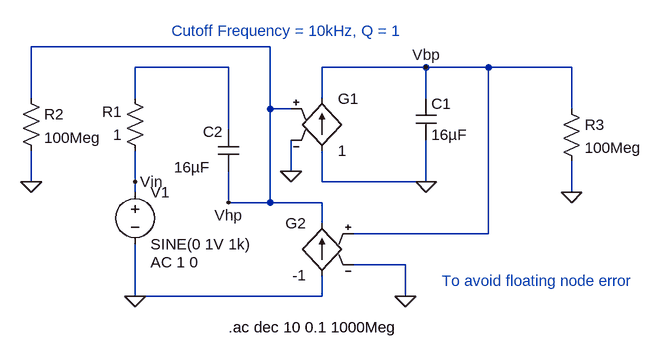
[diagram p0: schematic GmCInductor.asc]
GmCInductor.asc, the LTspice schematic file:
Version 4
SHEET 1 880 680
WIRE 288 -16 -80 -16
WIRE 224 16 80 16
WIRE 528 16 368 16
WIRE 624 16 528 16
WIRE 752 16 624 16
WIRE -80 64 -80 -16
WIRE 80 64 80 16
WIRE 368 64 368 16
WIRE 528 64 528 16
WIRE 288 80 288 -16
WIRE 320 80 288 80
WIRE 752 80 752 16
WIRE 224 112 224 16
WIRE 320 176 320 128
WIRE -80 192 -80 144
WIRE 80 192 80 144
WIRE 368 192 368 144
WIRE 528 192 528 128
WIRE 528 192 368 192
WIRE 80 208 80 192
WIRE 752 208 752 160
WIRE 224 224 224 176
WIRE 288 224 288 80
WIRE 288 224 224 224
WIRE 368 224 288 224
WIRE 368 256 368 224
WIRE 624 272 624 16
WIRE 624 272 416 272
WIRE 496 320 416 320
WIRE 80 368 80 288
WIRE 368 368 368 336
WIRE 368 368 80 368
WIRE 496 368 496 320
FLAG 496 368 0
FLAG 320 176 0
FLAG 80 368 0
FLAG 528 192 0
FLAG 80 192 Vin
FLAG 224 224 Vhp
FLAG 528 16 Vbp
FLAG -80 192 0
FLAG 752 208 0
SYMBOL g 368 48 R0
SYMATTR InstName G1
SYMATTR Value 1
SYMBOL g 368 240 M0
SYMATTR InstName G2
SYMATTR Value -1
SYMBOL cap 512 64 R0
SYMATTR InstName C1
SYMATTR Value 16µF
SYMBOL voltage 80 192 R0
WINDOW 123 24 124 Left 2
WINDOW 39 0 0 Left 0
SYMATTR InstName V1
SYMATTR Value SINE(0 1V 1k)
SYMATTR Value2 AC 1 0
SYMBOL res 96 160 R180
WINDOW 0 36 76 Left 2
WINDOW 3 36 40 Left 2
SYMATTR InstName R1
SYMATTR Value 1
SYMBOL cap 208 112 R0
WINDOW 0 -23 3 Left 2
WINDOW 3 -68 58 Left 2
SYMATTR InstName C2
SYMATTR Value 16µF
SYMBOL res -96 48 R0
SYMATTR InstName R2
SYMATTR Value 100Meg
SYMBOL res 736 64 R0
SYMATTR InstName R3
SYMATTR Value 100Meg
TEXT 136 -40 Left 2 ;Cutoff Frequency = 10kHz, Q = 1
TEXT 224 416 Left 2 !.ac dec 10 0.1 1000Meg
TEXT 552 344 Left 2 ;To avoid floating node error

The netlist it stands for:
* GmCInductor.asc
G1 0 Vbp Vhp 0 1
G2 0 Vhp Vbp 0 -1
C1 Vbp 0 16µF
V1 Vin 0 SINE(0 1V 1k) AC 1 0
R1 Vin N001 1
C2 N001 Vhp 16µF
R2 Vhp 0 100Meg
R3 Vbp 0 100Meg
* Cutoff Frequency = 10kHz, Q = 1
.ac dec 10 0.1 1000Meg
* To avoid floating node error
.backanno
.end